# EAGLE schematic olimexarduino (EAGLE 7.6.0)

## Sheet 1 of 2
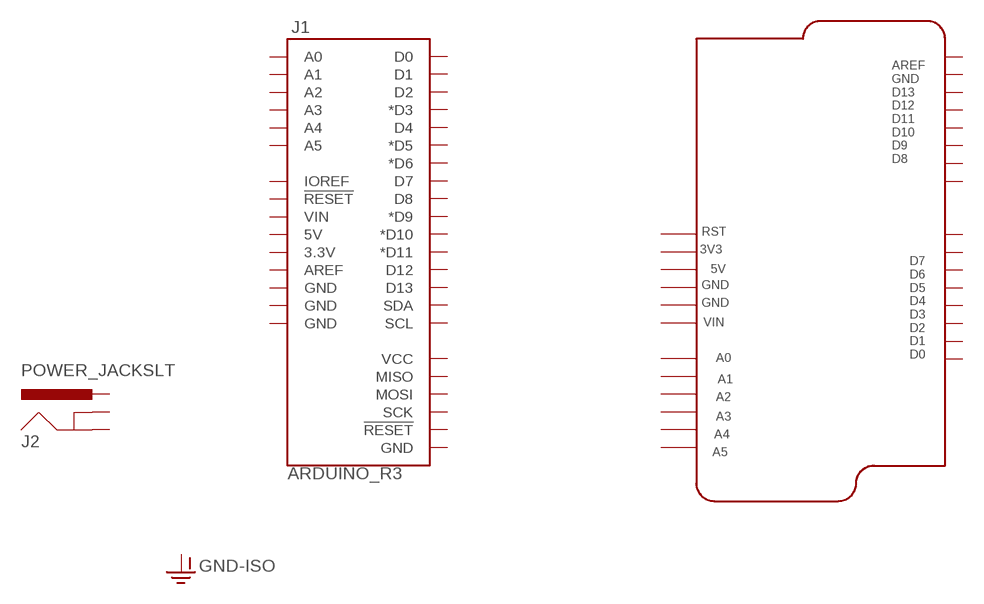
[diagram p0: schematic, sheet 1]

### Parts
J1  ARDUINO_R3  [ARDUINO_R3]
J2  POWER_JACKSLT  [POWER_JACK_SLOT]
Unconnected: J1.3.3V J1.5V J1.A0 J1.A1 J1.A2 J1.A3 J1.A4 J1.A5 J1.AREF J1.D0 J1.D1 J1.D2 J1.D3(*D3) J1.D4 J1.D5(*D5) J1.D6(*D6) J1.D7 J1.D8 J1.D9(*D9) J1.D10(*D10) J1.D11(*D11) J1.D12 J1.D13 J1.GND@1(GND) J1.GND@2(GND) J1.GND@3(GND) J1.GND@4(GND) J1.IOREF J1.MISO J1.MOSI J1.RESET@1(!RESET!) J1.RESET@2(!RESET!) J1.SCK J1.SCL J1.SDA J1.VCC J1.VIN J2.GND@1(GNDBREAK) J2.GND@2(GND) J2.PWR

### Notes on the sheet
- AREF
  GND
  D13
  D12
  D11
  D10
  D9
  D8
- RST
- 3V3
- 5V
- GND
- GND
- VIN
- D7
  D6
  D5
  D4
  D3
  D2
  D1
  D0
- A0
- A1
- A2
- A3
- A4
- A5

## Sheet 2 of 2

## Library data of the parts
J1 = SparkFun-Boards:ARDUINO_R3: Arduino R3 Footprint (w/ SPI header)
J2 = SparkFun-Connectors:POWER_JACK: Power Jack This is the standard 5.5mm barrel jack for power. The PTH is the most common, proven, reliable, footprint. The Slot footprint only works if the mill layer is transmitted to the PCB fab house so be warned. Mating wall wart : TOL-00298 (and others); PROD_ID: PRT-00119